# Altium project F2837x_180controlCARD_R1_3_SCH_PADS.PrjPcb (part 2 of 2)

## Sheet SUPPORT.SchDoc: F2837x controlCARD
size 431 x 279 mm; Organization: Texas Instruments; Revision: 1.3
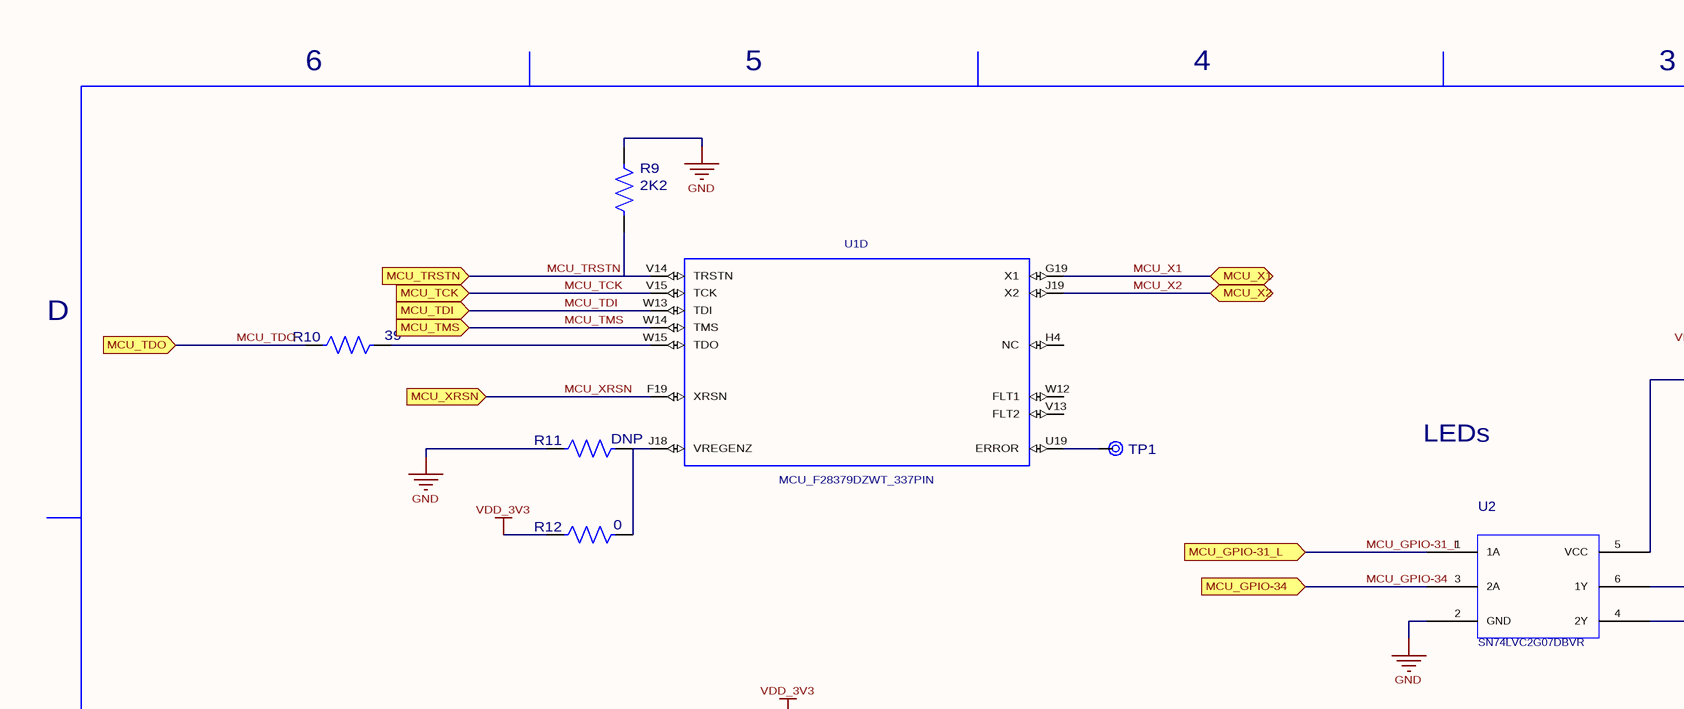
[diagram p19: SUPPORT.SchDoc, top left]
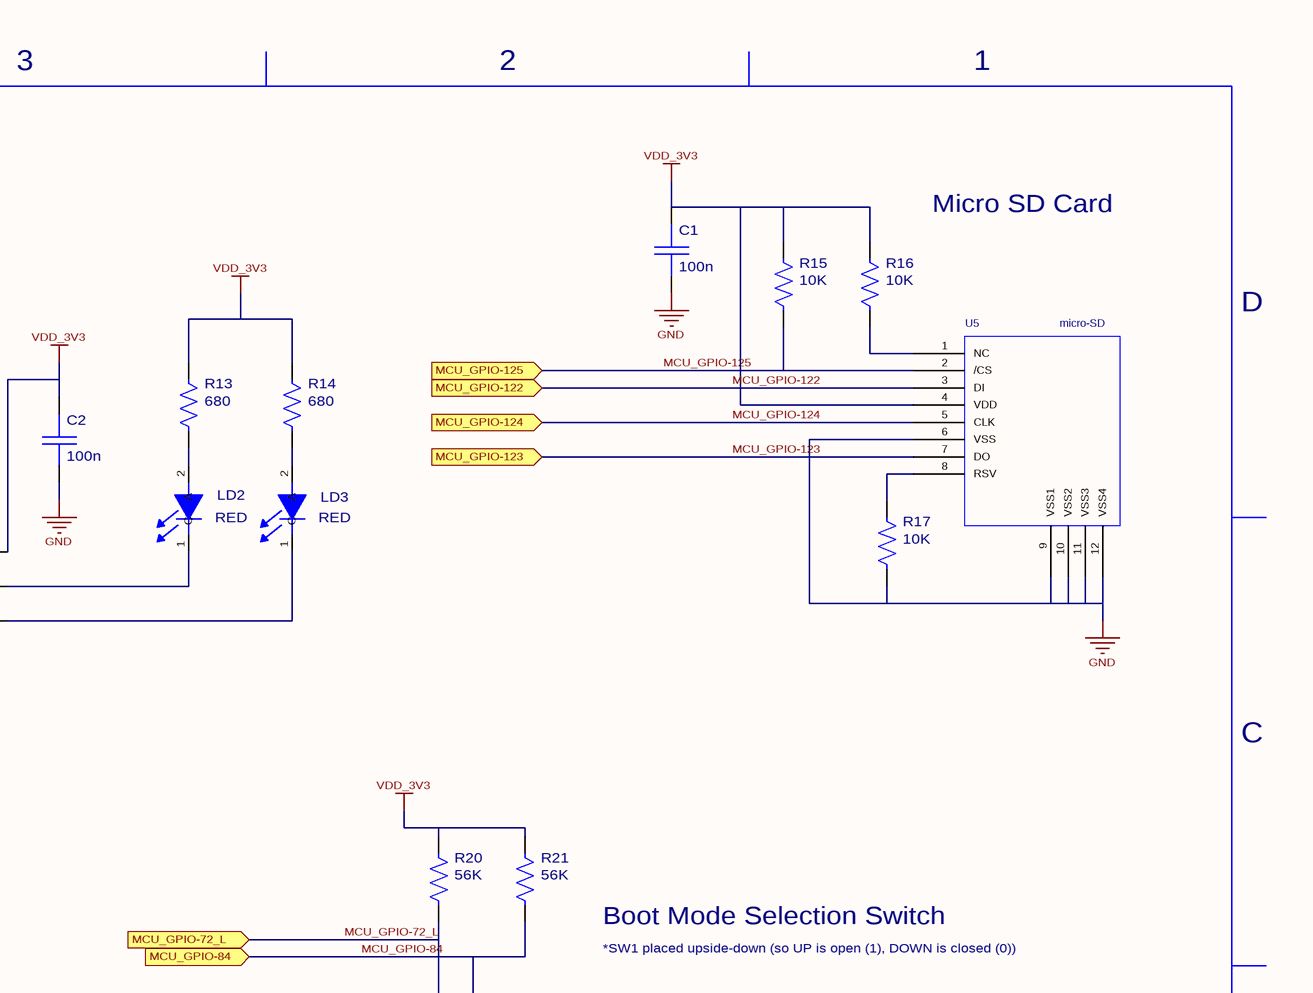
[diagram p20: SUPPORT.SchDoc, top right]
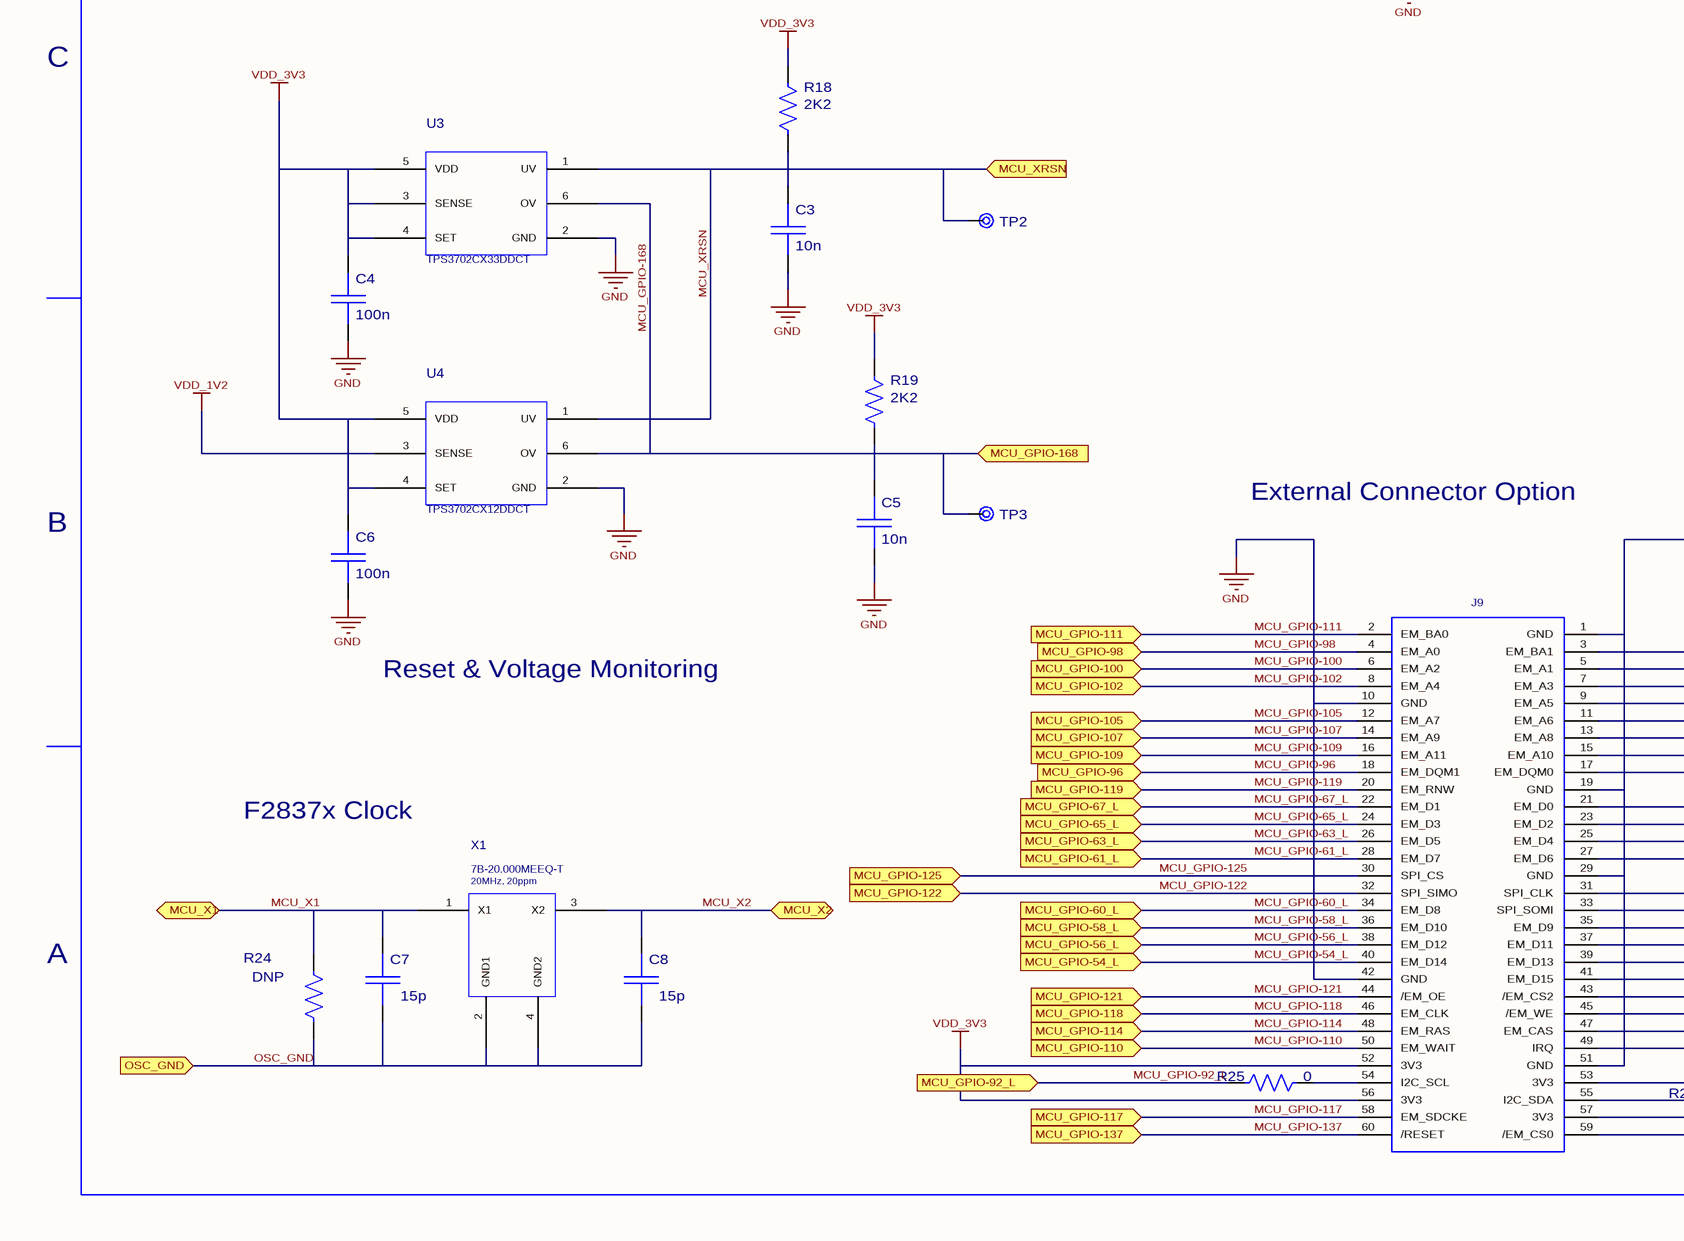
[diagram p21: SUPPORT.SchDoc, bottom left]
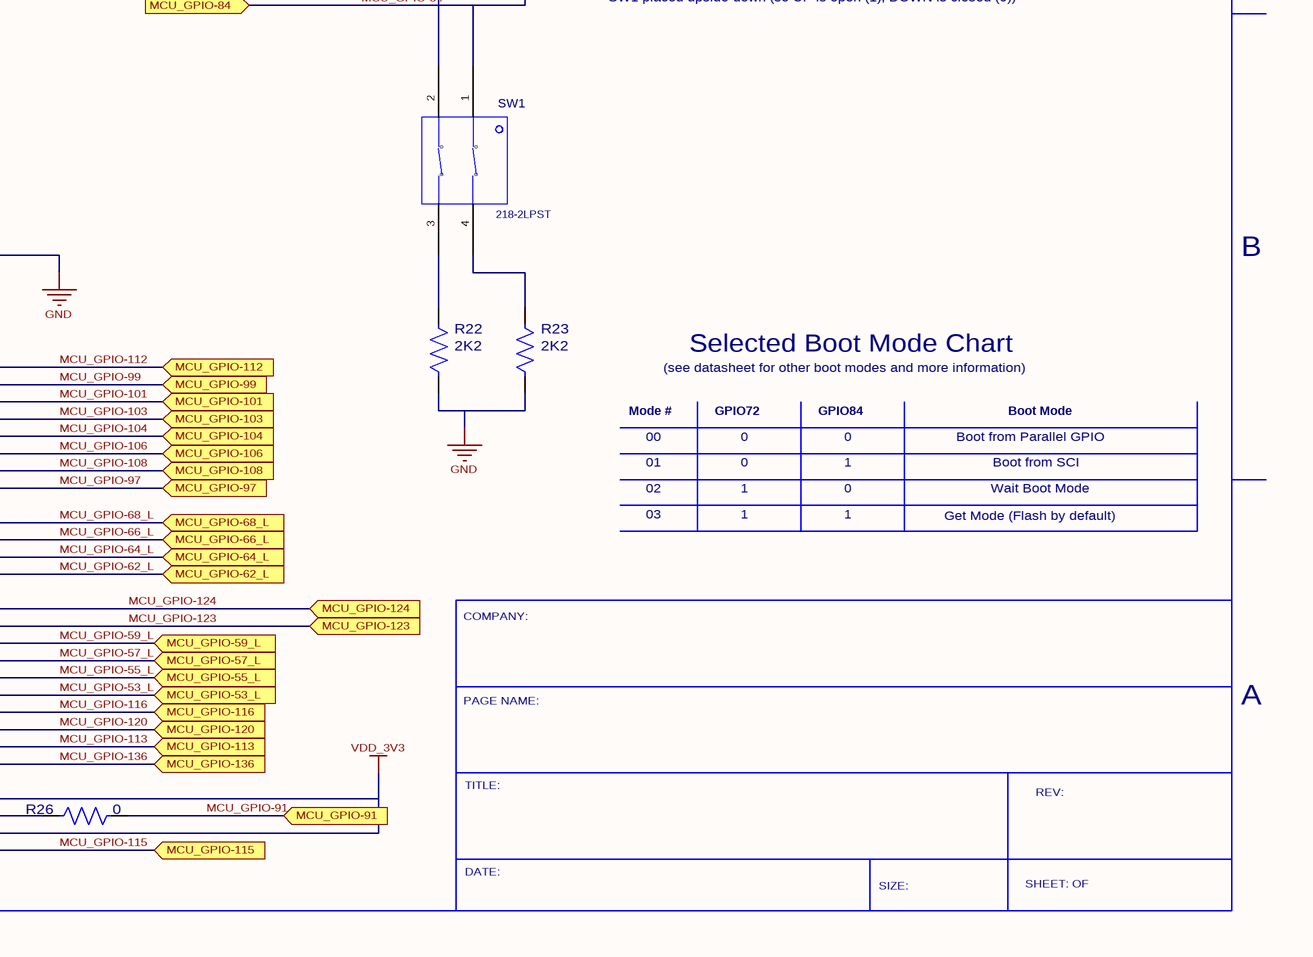
[diagram p22: SUPPORT.SchDoc, bottom right]

### Parts
C1  value 100n  [C0402]  (hidden comment: C0402_16V_X7R)
C2  value 100n  [C0402]  (hidden comment: C0402_16V_X7R)
C3  value 10n  [C0402]  (hidden comment: C0402_16V_X7R)
C4  value 100n  [C0402]  (hidden comment: C0402_16V_X7R)
C5  value 10n  [C0402]  (hidden comment: C0402_16V_X7R)
C6  value 100n  [C0402]  (hidden comment: C0402_16V_X7R)
C7  value 15p  [C0402]  (hidden comment: C0402_50V_NP0)
C8  value 15p  [C0402]  (hidden comment: C0402_50V_NP0)
J9  CONN_DF40C_CCARDIF_EMIFANDSPI  [DF40C-60DP-0.4V]  (value not drawn)
LD2  value RED  [LED0805]  (hidden comment: LED0805_RED)
LD3  value RED  [LED0805]  (hidden comment: LED0805_RED)
R9  value 2K2  [R0402]  (hidden comment: R0402_5%)
R10  value 39  [R0402]  (hidden comment: R0402_5%)
R11  value DNP  [R0402]  (hidden comment: R0402_5%)
R12  value 0  [R0402]  (hidden comment: R0402_5%)
R13  value 680  [R0402]  (hidden comment: R0402_5%)
R14  value 680  [R0402]  (hidden comment: R0402_5%)
R15  value 10K  [R0402]  (hidden comment: R0402_5%)
R16  value 10K  [R0402]  (hidden comment: R0402_5%)
R17  value 10K  [R0402]  (hidden comment: R0402_5%)
R18  value 2K2  [R0402]  (hidden comment: R0402_5%)
R19  value 2K2  [R0603]  (hidden comment: R0603_1%)
R20  value 56K  [R0402]  (hidden comment: R0402_5%)
R21  value 56K  [R0402]  (hidden comment: R0402_5%)
R22  value 2K2  [R0402]  (hidden comment: R0402_5%)
R23  value 2K2  [R0402]  (hidden comment: R0402_5%)
R24  value DNP  [R0402]  (hidden comment: R0402_5%)
R25  value 0  [R0402]  (hidden comment: R0402_5%)
R26  value 0  [R0402]  (hidden comment: R0402_5%)
SW1  value 218-2LPST  [SW_2POS_CTS218]  (hidden comment: SWITCH_2XSPST_SMT)
TP1  VIA_20_40  [VIA_20_40]  (value not drawn)
TP2  VIA_20_40  [VIA_20_40]  (value not drawn)
TP3  VIA_20_40  [VIA_20_40]  (value not drawn)
U1  MCU_F28379DZWT_337PIN  [TI_ZWT_337BGA]  (part D of 5)
U2  value SN74LVC2G07DBVR  [SOT-23-6]  (hidden comment: IC_LOGIC_SN74LVC2G07DBV)
U3  value TPS3702CX33DDCT  [SOT-23-6]  (hidden comment: IC_SVS_TPS3702CX33DDC)
U4  value TPS3702CX12DDCT  [SOT-23-6]  (hidden comment: IC_SVS_TPS3702CX12DDC)
U5  value micro-SD  [CONN_SDMICRO-3M-2900]  (hidden comment: CONN_MICROSD_2908-05WB-MG)
X1  value 20MHz, 20ppm  Part Number: 7B-20.000MEEQ-T  [XTAL_TXC_7B]  (hidden comment: XTAL_7B-20.000MEEQ-T)

### Ports
MCU_GPIO-31_L, MCU_GPIO-34, MCU_GPIO-53_L, MCU_GPIO-54_L, MCU_GPIO-55_L, MCU_GPIO-56_L, MCU_GPIO-57_L, MCU_GPIO-58_L, MCU_GPIO-59_L, MCU_GPIO-60_L, MCU_GPIO-61_L, MCU_GPIO-62_L, MCU_GPIO-63_L, MCU_GPIO-64_L, MCU_GPIO-65_L, MCU_GPIO-66_L, MCU_GPIO-67_L, MCU_GPIO-68_L, MCU_GPIO-72_L, MCU_GPIO-84, MCU_GPIO-91, MCU_GPIO-92_L, MCU_GPIO-96, MCU_GPIO-97, MCU_GPIO-98, MCU_GPIO-99, MCU_GPIO-100, MCU_GPIO-101, MCU_GPIO-102, MCU_GPIO-103, MCU_GPIO-104, MCU_GPIO-105, MCU_GPIO-106, MCU_GPIO-107, MCU_GPIO-108, MCU_GPIO-109, MCU_GPIO-110, MCU_GPIO-111, MCU_GPIO-112, MCU_GPIO-113, MCU_GPIO-114, MCU_GPIO-115, MCU_GPIO-116, MCU_GPIO-117, MCU_GPIO-118, MCU_GPIO-119, MCU_GPIO-120, MCU_GPIO-121, MCU_GPIO-122, MCU_GPIO-123, MCU_GPIO-124, MCU_GPIO-125, MCU_GPIO-136, MCU_GPIO-137, MCU_GPIO-168, MCU_TCK, MCU_TDI, MCU_TDO, MCU_TMS, MCU_TRSTN, MCU_X1 (bidir), MCU_X2 (bidir), MCU_XRSN, OSC_GND

### Nets
GND: C1.1 C2.1 C3.1 C4.1 C5.1 C6.1 J9.1(GND) J9.10(GND) J9.19(GND) J9.29(GND) J9.42(GND) J9.51(GND) R9.1 R11.1 R17.2 R22.2 R23.2 U2.2(GND) U3.2(GND) U4.2(GND) U5.6(VSS) U5.9(VSS1) U5.10(VSS2) U5.11(VSS3) U5.12(VSS4)
VDD_1V2: U4.3(SENSE)
VDD_3V3: C1.2 C2.2 C4.2 C6.2 J9.52(3V3) J9.53(3V3) J9.56(3V3) J9.57(3V3) R12.1 R13.1 R14.1 R15.1 R16.1 R18.1 R19.1 R20.1 R21.1 U2.5(VCC) U3.3(SENSE) U3.4(SET) U3.5(VDD) U4.4(SET) U4.5(VDD) U5.4(VDD)
MCU_GPIO-31_L: U2.1(1A) ; port MCU_GPIO-31_L
MCU_GPIO-34: U2.3(2A) ; port MCU_GPIO-34  [project net MCU_GPIO-20]
MCU_GPIO-53_L: J9.41(EM_D15) ; port MCU_GPIO-53_L
MCU_GPIO-54_L: J9.40(EM_D14) ; port MCU_GPIO-54_L
MCU_GPIO-55_L: J9.39(EM_D13) ; port MCU_GPIO-55_L
MCU_GPIO-56_L: J9.38(EM_D12) ; port MCU_GPIO-56_L
MCU_GPIO-57_L: J9.37(EM_D11) ; port MCU_GPIO-57_L
MCU_GPIO-58_L: J9.36(EM_D10) ; port MCU_GPIO-58_L
MCU_GPIO-59_L: J9.35(EM_D9) ; port MCU_GPIO-59_L
MCU_GPIO-60_L: J9.34(EM_D8) ; port MCU_GPIO-60_L
MCU_GPIO-61_L: J9.28(EM_D7) ; port MCU_GPIO-61_L
MCU_GPIO-62_L: J9.27(EM_D6) ; port MCU_GPIO-62_L
MCU_GPIO-63_L: J9.26(EM_D5) ; port MCU_GPIO-63_L
MCU_GPIO-64_L: J9.25(EM_D4) ; port MCU_GPIO-64_L
MCU_GPIO-65_L: J9.24(EM_D3) ; port MCU_GPIO-65_L
MCU_GPIO-66_L: J9.23(EM_D2) ; port MCU_GPIO-66_L
MCU_GPIO-67_L: J9.22(EM_D1) ; port MCU_GPIO-67_L
MCU_GPIO-68_L: J9.21(EM_D0) ; port MCU_GPIO-68_L
MCU_GPIO-72_L: R20.2 SW1.2(B_OUT2) ; port MCU_GPIO-72_L
MCU_GPIO-84: R21.2 SW1.1(A_OUT1) ; port MCU_GPIO-84
MCU_GPIO-91: R26.2 ; port MCU_GPIO-91
MCU_GPIO-92_L: R25.1 ; port MCU_GPIO-92_L
MCU_GPIO-96: J9.18(EM_DQM1) ; port MCU_GPIO-96
MCU_GPIO-97: J9.17(EM_DQM0) ; port MCU_GPIO-97
MCU_GPIO-98: J9.4(EM_A0) ; port MCU_GPIO-98
MCU_GPIO-99: J9.5(EM_A1) ; port MCU_GPIO-99
MCU_GPIO-100: J9.6(EM_A2) ; port MCU_GPIO-100
MCU_GPIO-101: J9.7(EM_A3) ; port MCU_GPIO-101
MCU_GPIO-102: J9.8(EM_A4) ; port MCU_GPIO-102
MCU_GPIO-103: J9.9(EM_A5) ; port MCU_GPIO-103
MCU_GPIO-104: J9.11(EM_A6) ; port MCU_GPIO-104
MCU_GPIO-105: J9.12(EM_A7) ; port MCU_GPIO-105
MCU_GPIO-106: J9.13(EM_A8) ; port MCU_GPIO-106
MCU_GPIO-107: J9.14(EM_A9) ; port MCU_GPIO-107
MCU_GPIO-108: J9.15(EM_A10) ; port MCU_GPIO-108
MCU_GPIO-109: J9.16(EM_A11) ; port MCU_GPIO-109
MCU_GPIO-110: J9.50(EM_WAIT) ; port MCU_GPIO-110
MCU_GPIO-111: J9.2(EM_BA0) ; port MCU_GPIO-111
MCU_GPIO-112: J9.3(EM_BA1) ; port MCU_GPIO-112
MCU_GPIO-113: J9.47(EM_CAS) ; port MCU_GPIO-113
MCU_GPIO-114: J9.48(EM_RAS) ; port MCU_GPIO-114
MCU_GPIO-115: J9.59(/EM_CS0) ; port MCU_GPIO-115
MCU_GPIO-116: J9.43(/EM_CS2) ; port MCU_GPIO-116
MCU_GPIO-117: J9.58(EM_SDCKE) ; port MCU_GPIO-117
MCU_GPIO-118: J9.46(EM_CLK) ; port MCU_GPIO-118
MCU_GPIO-119: J9.20(EM_RNW) ; port MCU_GPIO-119
MCU_GPIO-120: J9.45(/EM_WE) ; port MCU_GPIO-120
MCU_GPIO-121: J9.44(/EM_OE) ; port MCU_GPIO-121
MCU_GPIO-122: J9.32(SPI_SIMO) U5.3(DI) ; port MCU_GPIO-122
MCU_GPIO-123: J9.33(SPI_SOMI) U5.7(DO) ; port MCU_GPIO-123
MCU_GPIO-124: J9.31(SPI_CLK) U5.5(CLK) ; port MCU_GPIO-124
MCU_GPIO-125: J9.30(SPI_CS) R15.2 U5.2(/CS) ; port MCU_GPIO-125
MCU_GPIO-136: J9.49(IRQ) ; port MCU_GPIO-136
MCU_GPIO-137: J9.60(/RESET) ; port MCU_GPIO-137
MCU_GPIO-168: C5.2 R19.2 TP3.1 U3.6(OV) U4.6(OV) ; port MCU_GPIO-168
MCU_TCK: U1.V15(TCK) ; port MCU_TCK
MCU_TDI: U1.W13(TDI) ; port MCU_TDI
MCU_TDO: R10.1 ; port MCU_TDO
MCU_TMS: U1.W14(TMS) ; port MCU_TMS
MCU_TRSTN: R9.2 U1.V14(TRSTN) ; port MCU_TRSTN
MCU_X1: C7.2 R24.1 U1.G19(X1) X1.1(X1) ; port MCU_X1
MCU_X2: C8.2 U1.J19(X2) X1.3(X2) ; port MCU_X2
MCU_XRSN: C3.2 R18.2 TP2.1 U1.F19(XRSN) U3.1(UV) U4.1(UV) ; port MCU_XRSN
OSC_GND: C7.1 C8.1 R24.2 X1.2(GND1) X1.4(GND2) ; port OSC_GND
NetJ9_54: J9.54(I2C_SCL) R25.2
NetJ9_55: J9.55(I2C_SDA) R26.1
NetLD2_1: LD2.1(C) U2.6(1Y)
NetLD2_2: LD2.2(A) R13.2
NetLD3_1: LD3.1(C) U2.4(2Y)
NetLD3_2: LD3.2(A) R14.2
NetR10_2: R10.2 U1.W15(TDO)
NetR11_2: R11.2 R12.2 U1.J18(VREGENZ)
NetR16_2: R16.2 U5.1(NC)
NetR17_1: R17.1 U5.8(RSV)
NetR22_1: R22.1 SW1.3(B_IN1)
NetR23_1: R23.1 SW1.4(A_IN1)
NetTP1_1: TP1.1 U1.U19(ERROR)

Not connected (* = marked no-connect by the designer): U1 H4(NC) V13(FLT2) W12(FLT1)

### Notes on the sheet
- 6
- 5
- 4
- 3
- 2
- 1
- Micro SD Card
- D
- LEDs
- C
- *SW1 placed upside-down (so UP is open (1), DOWN is closed (0))
- Boot Mode Selection Switch
- External Connector Option
- B
- Reset & Voltage Monitoring
- (see datasheet for other boot modes and more information)
- Selected Boot Mode Chart
- Mode #
- 01
- 00
- GPIO72
- 0
- GPIO84
- Boot from Parallel GPIO
- Boot from SCI
- Boot Mode
- F2837x Clock
- 03
- 02
- Get Mode (Flash by default)
- Wait Boot Mode
- COMPANY:
- A
- PAGE NAME:
- TITLE:
- REV:
- DATE:
- SIZE:
- SHEET: OF
- (in symbol SWITCH_2XSPST_SMT) o

### Library data of the parts
C1-C6 = C0402_16V_X7R: CAP CER 16V 10% X7R 0402; Decal: C0402; PCB DECAL: C0402
C7 C8 = C0402_50V_NP0: CAP CER 50V NP0 0402; Decal: C0402; PCB DECAL: C0402
J9 = CONN_DF40C_CCARDIF_EMIFANDSPI: 60pin connector - SMT, Hirose DF40C-60DP-0.4V(51); Decal: DF40C-60DP-0.4V; Digikey: H11628CT-ND; Manufacturer: Hirose; Part Number: DF40C-60DP-0.4V(51); PCB DECAL: DF40C-60DP-0.4V
LD2 LD3 = LED0805_RED: LED RED 0805 SMD, Diffused, 647nm; Decal: LED0805; PCB DECAL: LED0805
R9-R18 R20-R26 = R0402_5%: RES 1/16W 5% 0402 SMD; Decal: R0402; PCB DECAL: R0402
R19 = R0603_1%: RES 1/10W 1% 0603 SMD; Decal: R0603; PCB DECAL: R0603
SW1 = SWITCH_2XSPST_SMT: 2xSPST DIP switch SMT, half-pitch; Manufacturer: CTS Electrocomponents; Decal: SW_2POS_CTS218; Digikey: CT2182LPST-ND; Part Number: 218-2LPST; Size: 3.71 L x 8.89 W, 1.27 LS (mm); Height: 2.65 (mm); PCB DECAL: SW_2POS_CTS218
TP1-TP3 = VIA_20_40: Via, 20 ID, 40 OD (mil); Decal: VIA_20_40; Size: 20 ID, 40 OD (mil); PCB DECAL: VIA_20_40
U1 = MCU_F28379DZWT_337PIN: MCU F2837x 337pin ZWT BGA; Part Number: TMS320F28379DZWT; Decal: TI_ZWT_337BGA; PCB DECAL: TI_ZWT_337BGA
U2 = IC_LOGIC_SN74LVC2G07DBV: Buffer Line Driver, non-inverting, 32mA; Manufacturer: Texas Instruments; PCB DECAL: SOT-23-6; Decal: SOT-23-6; Digikey: 296-13494-1-ND; Part Number: SN74LVC2G07DBVR
U3 = IC_SVS_TPS3702CX33DDC: Volage Monitor, 3.3V, 5% or 10%; Manufacturer: Texas Instruments; Decal: SOT-23-6; Digikey: 296-39651-1-ND; Part Number: TPS3702CX33DDCT; PCB DECAL: SOT-23-6
U4 = IC_SVS_TPS3702CX12DDC: Volage Monitor, 1.2V, 5% or 10%; Manufacturer: Texas Instruments; Decal: SOT-23-6; Digikey: 296-42074-1-ND; Part Number: TPS3702CX12DDCT; PCB DECAL: SOT-23-6
U5 = CONN_MICROSD_2908-05WB-MG: micro SD Connector+Ejector, 10 (8+2) positions, SMT-top; Manufacturer: 3M; Decal: CONN_SDMICRO-3M-2900; Digikey: 3M5607CT-ND; Height: 1.85 (mm); Part Number: 2908-05WB-MG; PCB DECAL: CONN_SDMICRO-3M-2900
X1 = XTAL_7B-20.000MEEQ-T: 20MHz Crystal, 20ppm; Manufacturer: TXC Corporation; Decal: XTAL_TXC_7B; Digikey: 887-1303-1-ND; Height: 1.05 (mm); Size: 5 L x 3.2 W (mm); PCB DECAL: XTAL_TXC_7B

## Sheet XDS100V2_EMULATOR.SchDoc: F2837x controlCARD
size 431 x 279 mm; Organization: Texas Instruments; Revision: 1.3
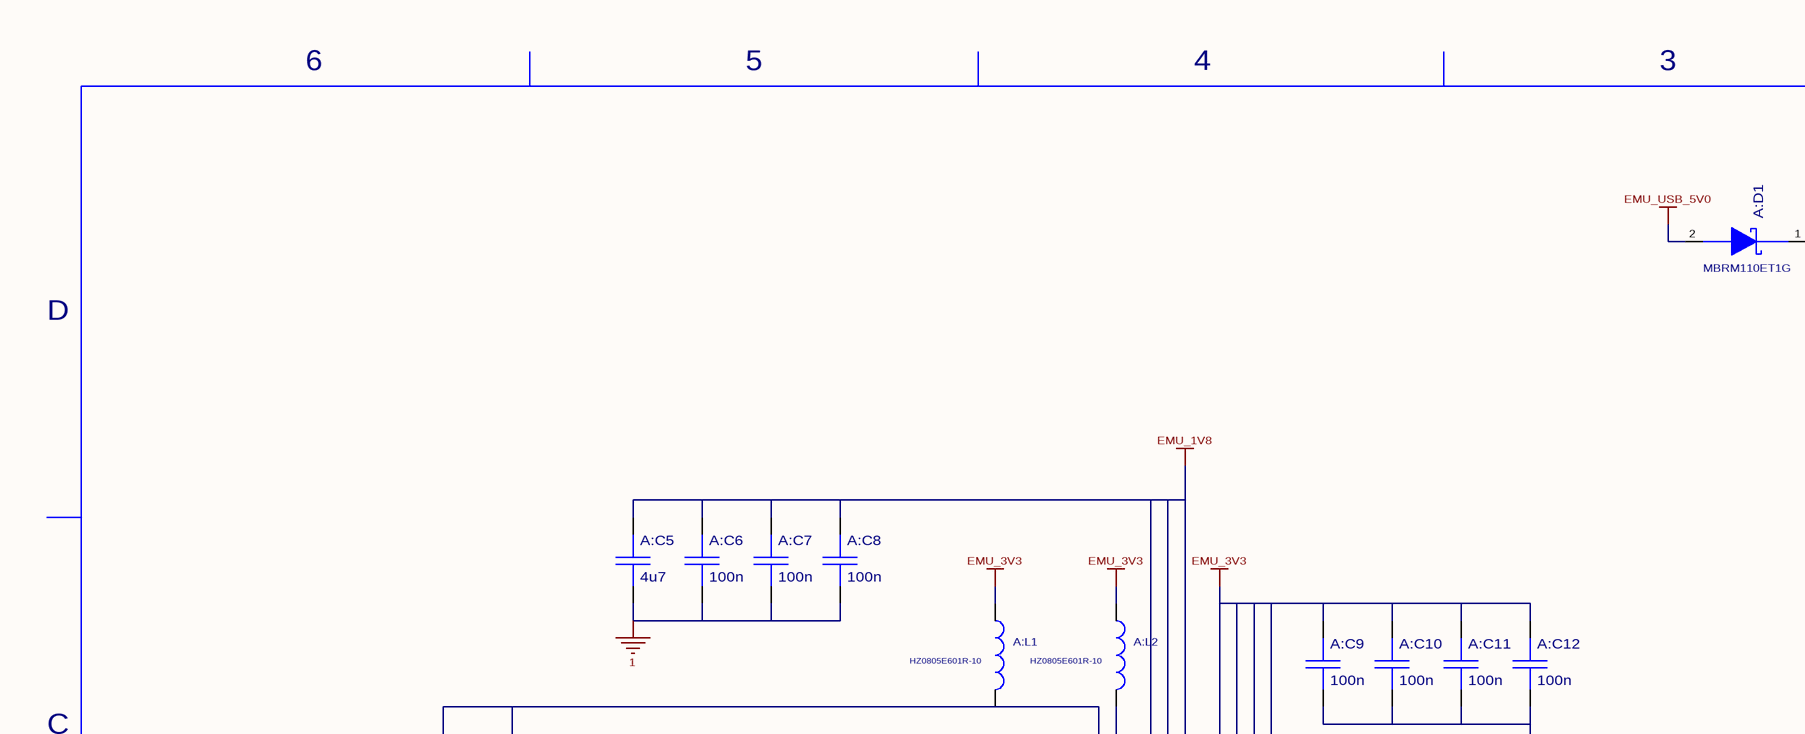
[diagram p23: XDS100V2_EMULATOR.SchDoc, top left]
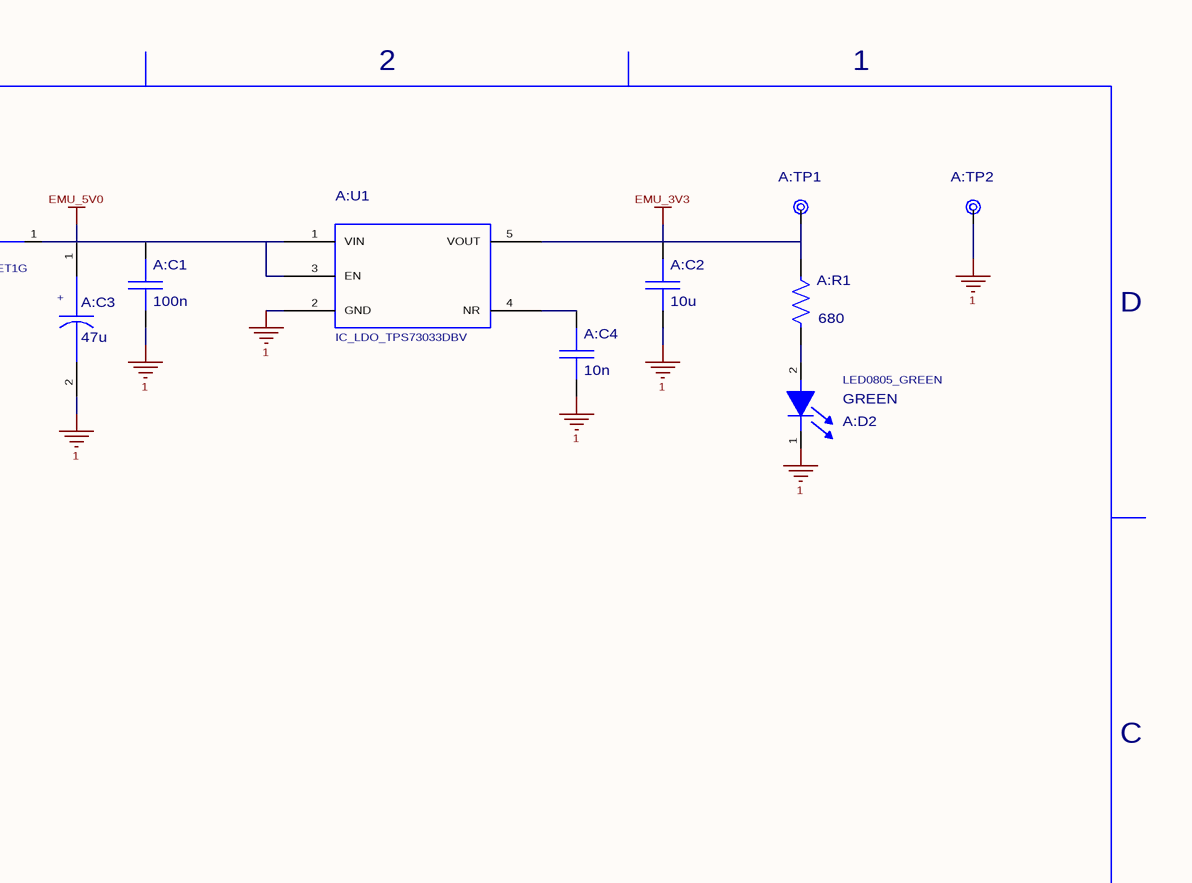
[diagram p24: XDS100V2_EMULATOR.SchDoc, top right]
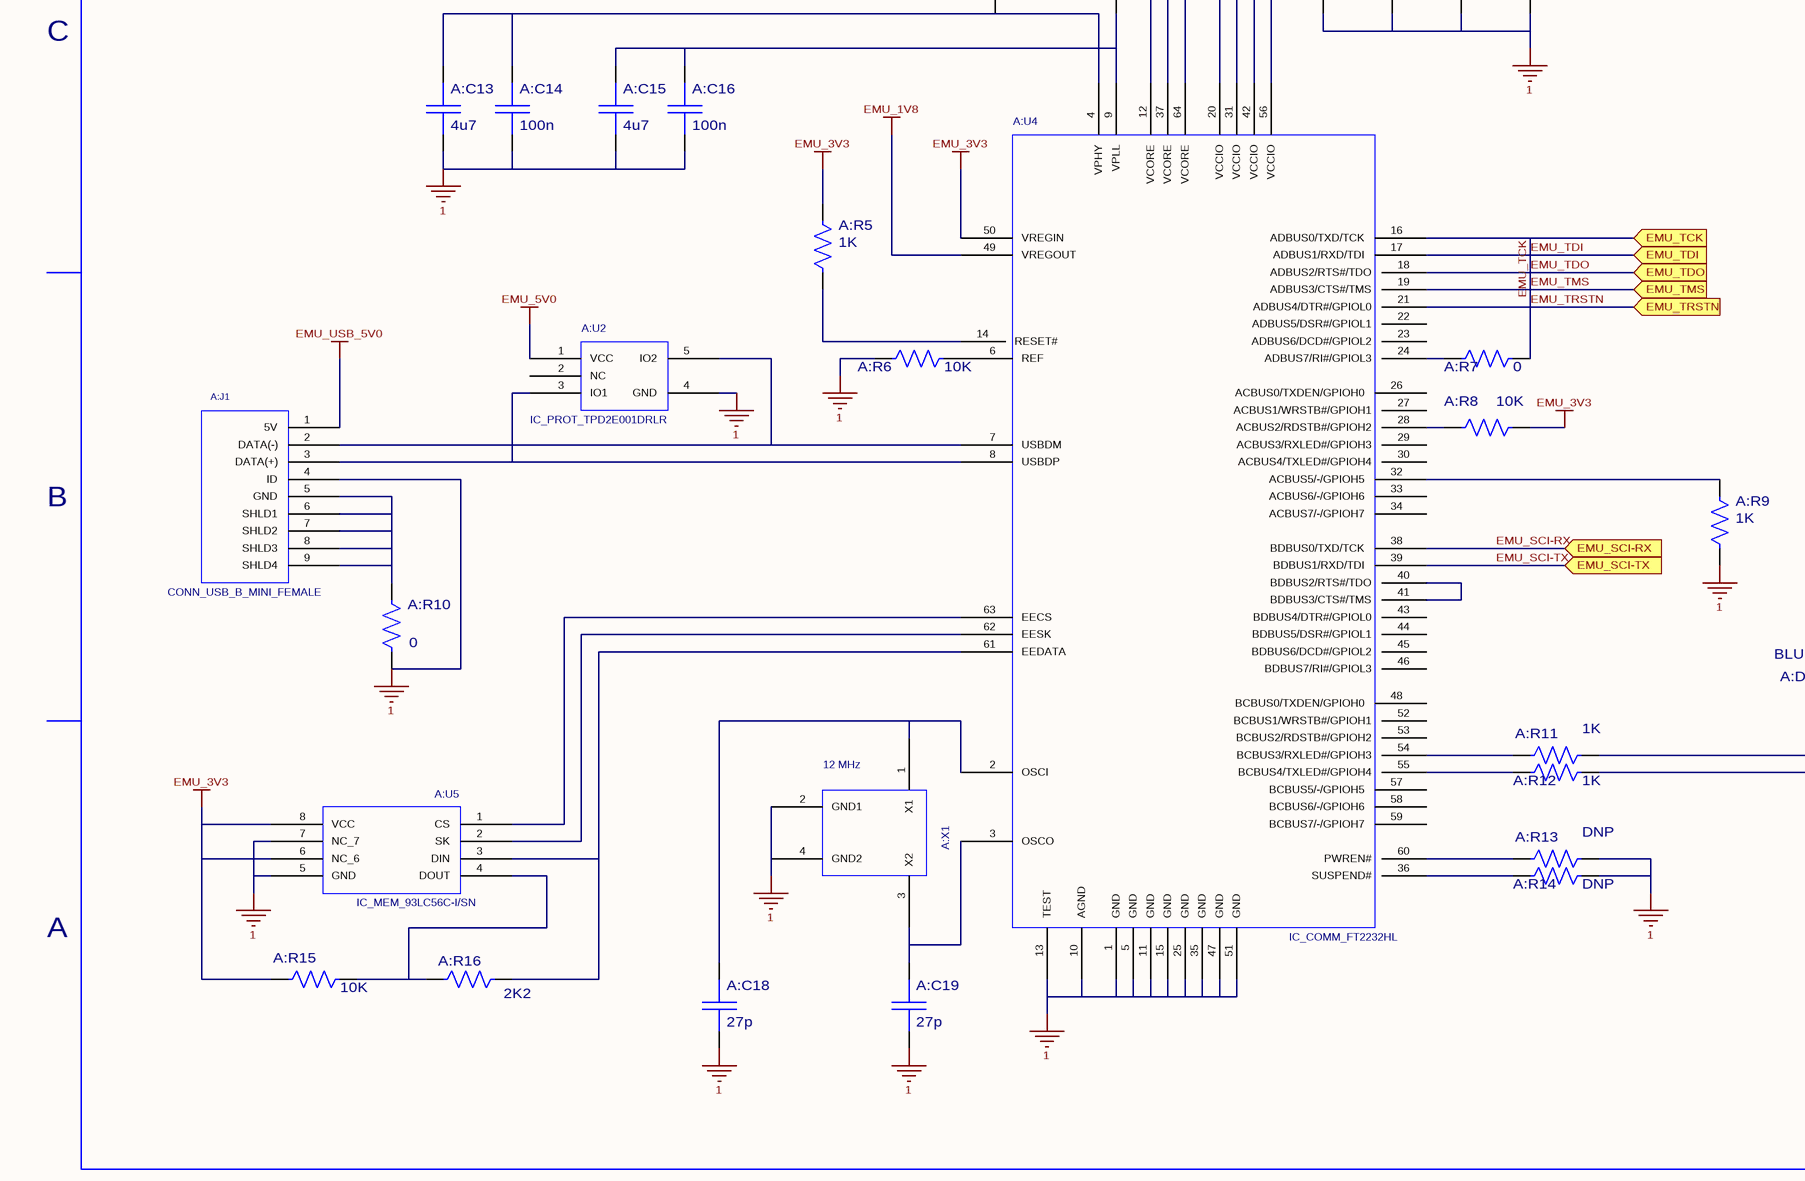
[diagram p25: XDS100V2_EMULATOR.SchDoc, bottom left]
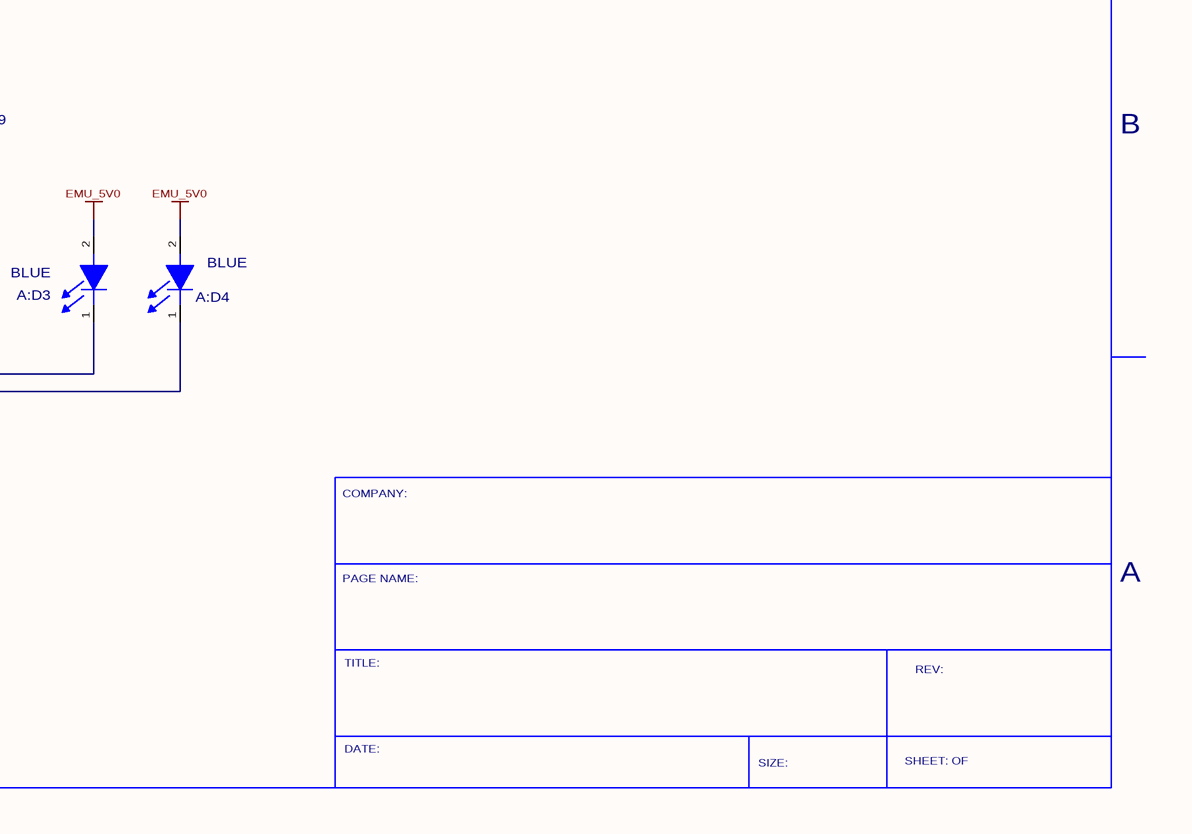
[diagram p26: XDS100V2_EMULATOR.SchDoc, bottom right]

### Parts
A:C1  value 100n  [C0402]  (hidden comment: C0402_16V_X7R)
A:C2  value 10u  [C0603]  (hidden comment: C0603_16V_X7R)
A:C3  value 47u  [C0805P]  (hidden comment: C0805_10V_TANT)
A:C4  value 10n  [C0402]  (hidden comment: C0402_16V_X7R)
A:C5  value 4u7  [C0603]  (hidden comment: C0603_16V_X7R)
A:C6  value 100n  [C0402]  (hidden comment: C0402_16V_X7R)
A:C7  value 100n  [C0402]  (hidden comment: C0402_16V_X7R)
A:C8  value 100n  [C0402]  (hidden comment: C0402_16V_X7R)
A:C9  value 100n  [C0402]  (hidden comment: C0402_16V_X7R)
A:C10  value 100n  [C0402]  (hidden comment: C0402_16V_X7R)
A:C11  value 100n  [C0402]  (hidden comment: C0402_16V_X7R)
A:C12  value 100n  [C0402]  (hidden comment: C0402_16V_X7R)
A:C13  value 4u7  [C0603]  (hidden comment: C0603_16V_X7R)
A:C14  value 100n  [C0402]  (hidden comment: C0402_16V_X7R)
A:C15  value 4u7  [C0603]  (hidden comment: C0603_16V_X7R)
A:C16  value 100n  [C0402]  (hidden comment: C0402_16V_X7R)
A:C18  value 27p  [C0402]  (hidden comment: C0402_50V_NP0)
A:C19  value 27p  [C0402]  (hidden comment: C0402_50V_NP0)
A:D1  Part Number: MBRM110ET1G  [DO-216AA]  (hidden comment: DIODE_SCHOTTKY_MBRM110ET1G)
A:D2  LED0805_GREEN  value GREEN  [LED0805]
A:D3  value BLUE  [LED0805]  (hidden comment: LED0805_BLUE)
A:D4  value BLUE  [LED0805]  (hidden comment: LED0805_BLUE)
A:J1  CONN_USB_B_MINI_FEMALE  [CONN_USB_B_MINI_FEMALE]
A:L1  Part Number: HZ0805E601R-10  [L0805]  (hidden comment: L0805_HZ0805E601R-10)
A:L2  Part Number: HZ0805E601R-10  [L0805]  (hidden comment: L0805_HZ0805E601R-10)
A:R1  value 680  [R0402]  (hidden comment: R0402_5%)
A:R5  value 1K  [R0402]  (hidden comment: R0402_5%)
A:R6  value 10K  [R0402]  (hidden comment: R0402_5%)
A:R7  value 0  [R0402]  (hidden comment: R0402_5%)
A:R8  value 10K  [R0402]  (hidden comment: R0402_5%)
A:R9  value 1K  [R0402]  (hidden comment: R0402_5%)
A:R10  value 0  [R0402]  (hidden comment: R0402_5%)
A:R11  value 1K  [R0402]  (hidden comment: R0402_5%)
A:R12  value 1K  [R0402]  (hidden comment: R0402_5%)
A:R13  value DNP  [R0402]  (hidden comment: R0402_5%)
A:R14  value DNP  [R0402]  (hidden comment: R0402_5%)
A:R15  value 10K  [R0402]  (hidden comment: R0402_5%)
A:R16  value 2K2  [R0402]  (hidden comment: R0402_5%)
A:TP1  VIA_20_40  [VIA_20_40]  (value not drawn)
A:TP2  VIA_20_40  [VIA_20_40]  (value not drawn)
A:U1  IC_LDO_TPS73033DBV  [SOT-23-5]
A:U2  IC_PROT_TPD2E001DRLR  [SOT-553-5]
A:U4  IC_COMM_FT2232HL  [QFN-64]
A:U5  IC_MEM_93LC56C-I/SN  [SOIC-8]
A:X1  value 12 MHz  [OSC_ECS-120-20-30B]  (hidden comment: OSC_ECS-120-20-30B-TR)

### Ports
EMU_SCI-RX, EMU_SCI-TX, EMU_TCK, EMU_TDI, EMU_TDO, EMU_TMS, EMU_TRSTN

### Nets
1: A:C1.1 A:C2.1 A:C3.2 A:C4.1 A:C5.1 A:C6.1 A:C7.1 A:C8.1 A:C9.1 A:C10.1 A:C11.1 A:C12.1 A:C13.1 A:C14.1 A:C15.1 A:C16.1 A:C18.1 A:C19.1 A:D2.1(C) A:J1.4(ID) A:R6.1 A:R9.2 A:R10.2 A:R13.2 A:R14.2 A:TP2.1 A:U1.2(GND) A:U2.4(GND) A:U4.1(GND) A:U4.5(GND) A:U4.10(AGND) A:U4.11(GND) A:U4.13(TEST) A:U4.15(GND) A:U4.25(GND) A:U4.35(GND) A:U4.47(GND) A:U4.51(GND) A:U5.5(GND) A:U5.7(NC_7) A:X1.2(GND1) A:X1.4(GND2)
EMU_1V8: A:C5.2 A:C6.2 A:C7.2 A:C8.2 A:U4.12(VCORE) A:U4.37(VCORE) A:U4.49(VREGOUT) A:U4.64(VCORE)
EMU_3V3: A:C2.2 A:C9.2 A:C10.2 A:C11.2 A:C12.2 A:L1.1 A:L2.1 A:R1.1 A:R5.1 A:R8.2 A:R15.1 A:TP1.1 A:U1.5(VOUT) A:U4.20(VCCIO) A:U4.31(VCCIO) A:U4.42(VCCIO) A:U4.50(VREGIN) A:U4.56(VCCIO) A:U5.6(NC_6) A:U5.8(VCC)
EMU_5V0: A:C1.2 A:C3.1 A:D1.1(C) A:D3.2(A) A:D4.2(A) A:U1.1(VIN) A:U1.3(EN) A:U2.1(VCC)
EMU_USB_5V0: A:D1.2(A) A:J1.1(5V)
EMU_SCI-RX: A:U4.38(BDBUS0/TXD/TCK) ; port EMU_SCI-RX
EMU_SCI-TX: A:U4.39(BDBUS1/RXD/TDI) ; port EMU_SCI-TX
EMU_TCK: A:R7.2 A:U4.16(ADBUS0/TXD/TCK) A:U4.17(ADBUS1/RXD/TDI) A:U4.18(ADBUS2/RTS#/TDO) A:U4.19(ADBUS3/CTS#/TMS) A:U4.21(ADBUS4/DTR#/GPIOL0) ; port EMU_TCK, port EMU_TDI, port EMU_TRSTN, port EMU_TMS, port EMU_TDO  [also labelled EMU_TDI, EMU_TDO, EMU_TMS, EMU_TRSTN]
NetA:C4_2: A:C4.2 A:U1.4(NR)
NetA:C13_2: A:C13.2 A:C14.2 A:L1.2 A:U4.4(VPHY)
NetA:C15_2: A:C15.2 A:C16.2 A:L2.2 A:U4.9(VPLL)
NetA:C18_2: A:C18.2 A:U4.2(OSCI) A:X1.1(X1)
NetA:C19_2: A:C19.2 A:U4.3(OSCO) A:X1.3(X2)
NetA:D2_2: A:D2.2(A) A:R1.2
NetA:D3_1: A:D3.1(C) A:R11.2
NetA:D4_1: A:D4.1(C) A:R12.2
NetA:J1_2: A:J1.2(DATA(-)) A:U2.5(IO2) A:U4.7(USBDM)
NetA:J1_3: A:J1.3(DATA(+)) A:U2.3(IO1) A:U4.8(USBDP)
NetA:J1_5: A:J1.5(GND) A:J1.6(SHLD1) A:J1.7(SHLD2) A:J1.8(SHLD3) A:J1.9(SHLD4) A:R10.1
NetA:R5_2: A:R5.2 A:U4.14(RESET#)
NetA:R6_2: A:R6.2 A:U4.6(REF)
NetA:R7_1: A:R7.1 A:U4.24(ADBUS7/RI#/GPIOL3)
NetA:R8_1: A:R8.1 A:U4.28(ACBUS2/RDSTB#/GPIOH2)
NetA:R9_1: A:R9.1 A:U4.32(ACBUS5/-/GPIOH5)
NetA:R11_1: A:R11.1 A:U4.54(BCBUS3/RXLED#/GPIOH3)
NetA:R12_1: A:R12.1 A:U4.55(BCBUS4/TXLED#/GPIOH4)
NetA:R13_1: A:R13.1 A:U4.60(PWREN#)
NetA:R14_1: A:R14.1 A:U4.36(SUSPEND#)
NetA:R15_2: A:R15.2 A:R16.1 A:U5.4(DOUT)
NetA:R16_2: A:R16.2 A:U4.61(EEDATA) A:U5.3(DIN)
NetA:U4_40: A:U4.40(BDBUS2/RTS#/TDO) A:U4.41(BDBUS3/CTS#/TMS)
NetA:U4_62: A:U4.62(EESK) A:U5.2(SK)
NetA:U4_63: A:U4.63(EECS) A:U5.1(CS)

Not connected (* = marked no-connect by the designer): A:U2 2(NC); A:U4 22(ADBUS5/DSR#/GPIOL1) 23(ADBUS6/DCD#/GPIOL2) 26(ACBUS0/TXDEN/GPIOH0) 27(ACBUS1/WRSTB#/GPIOH1) 29(ACBUS3/RXLED#/GPIOH3) 30(ACBUS4/TXLED#/GPIOH4) 33(ACBUS6/-/GPIOH6) 34(ACBUS7/-/GPIOH7) 43(BDBUS4/DTR#/GPIOL0) 44(BDBUS5/DSR#/GPIOL1) 45(BDBUS6/DCD#/GPIOL2) 46(BDBUS7/RI#/GPIOL3) 48(BCBUS0/TXDEN/GPIOH0) 52(BCBUS1/WRSTB#/GPIOH1) 53(BCBUS2/RDSTB#/GPIOH2) 57(BCBUS5/-/GPIOH5) 58(BCBUS6/-/GPIOH6) 59(BCBUS7/-/GPIOH7)

### Notes on the sheet
- 6
- 5
- 4
- 3
- 2
- 1
- D
- C
- B
- COMPANY:
- A
- PAGE NAME:
- TITLE:
- REV:
- DATE:
- SIZE:
- SHEET: OF
- (in symbol C0805_10V_TANT) +

### Library data of the parts
A:C1 A:C4 A:C6-A:C12 A:C14 A:C16 = C0402_16V_X7R: CAP CER 16V 10% X7R 0402; Decal: C0402; PCB DECAL: C0402
A:C2 = C0603_16V_X7R: CAP CER 6.3V 20% X5R 0603; Decal: C0603; PCB DECAL: C0603
A:C3 = C0805_10V_TANT: CAP TANT 20% 0805 6.3V; Part Number: TCTP0J476M8R; Decal: C0805P; Digikey: 511-1682-1-ND; PCB DECAL: C0805P
A:C5 A:C13 A:C15 = C0603_16V_X7R: CAP CER 6.3V 10% X5R 0603; Decal: C0603; PCB DECAL: C0603
A:C18 A:C19 = C0402_50V_NP0: CAP CER 50V NP0 0402; Decal: C0402; PCB DECAL: C0402
A:D1 = DIODE_SCHOTTKY_MBRM110ET1G: DIODE SCHOTTKY 10V 1A POWERMITE; Manufacturer: On Semiconductor; Decal: DO-216AA; Digikey: MBRM110ET1GOSCT-ND; PCB DECAL: DO-216AA
A:D2 = LED0805_GREEN: LED GREEN 0805 SMD, Diffused, 567nm; Decal: LED0805; PCB DECAL: LED0805
A:D3 A:D4 = LED0805_BLUE: LED BLUE 0805 SMD, Clear, 470nm; Decal: LED0805; PCB DECAL: LED0805
A:J1 = CONN_USB_B_MINI_FEMALE: CONN RECEPT MINI USB2.0 5POS; Part Number: UX60-MB-5ST; Decal: CONN_USB_B_MINI_FEMALE; Digikey: H2959CT-ND; PCB DECAL: CONN_USB_B_MINI_FEMALE
A:L1 A:L2 = L0805_HZ0805E601R-10: FERRITE 500MA 600 OHM 0805 SMD; Decal: L0805; Digikey: 240-2399-1-ND; PCB DECAL: L0805
A:R1 A:R5-A:R16 = R0402_5%: RES 1/16W 5% 0402 SMD; Decal: R0402; PCB DECAL: R0402
A:TP1 A:TP2 = VIA_20_40: Via, 20 ID, 40 OD (mil); Decal: VIA_20_40; Size: 20 ID, 40 OD (mil); PCB DECAL: VIA_20_40
A:U1 = IC_LDO_TPS73033DBV: IC LDO REG HI-PSRR 3.3V SOT23-5; Decal: SOT-23-5; Digikey: 296-17580-1-ND; Part Number: TPS73033DBV; PCB DECAL: SOT-23-5
A:U2 = IC_PROT_TPD2E001DRLR: IC ESD-PROT ARRAY 2CH SOT-5; Decal: SOT-553-5; Digikey: 296-21883-1-ND; Part Number: TPD2E001DRLR; PCB DECAL: SOT-553-5
A:U4 = IC_COMM_FT2232HL: IC USB HS DUAL UART/FIFO 64-QFN; Decal: QFN-64; Digikey: 768-1024-1-ND; Part Number: FT2232HL; PCB DECAL: QFN-64
A:U5 = IC_MEM_93LC56C-I/SN: IC EEPROM 2KBIT 3MHZ 8SOIC; Decal: SOIC-8; Digikey: 93LC56C-I/SN-ND; Part Number: 93LC56C-I/SN; PCB DECAL: SOIC-8
A:X1 = OSC_ECS-120-20-30B-TR: CRYSTAL 12.000 MHZ 20PF SMD; Decal: OSC_ECS-120-20-30B; Digikey: XC1118CT-ND; Part Number: ECS-120-20-30B-TR; PCB DECAL: OSC_ECS-120-20-30B

## Sheet EMULATOR_INTERFACE.SchDoc: F2837x controlCARD
size 431 x 279 mm; Organization: Texas Instruments; Revision: 1.3
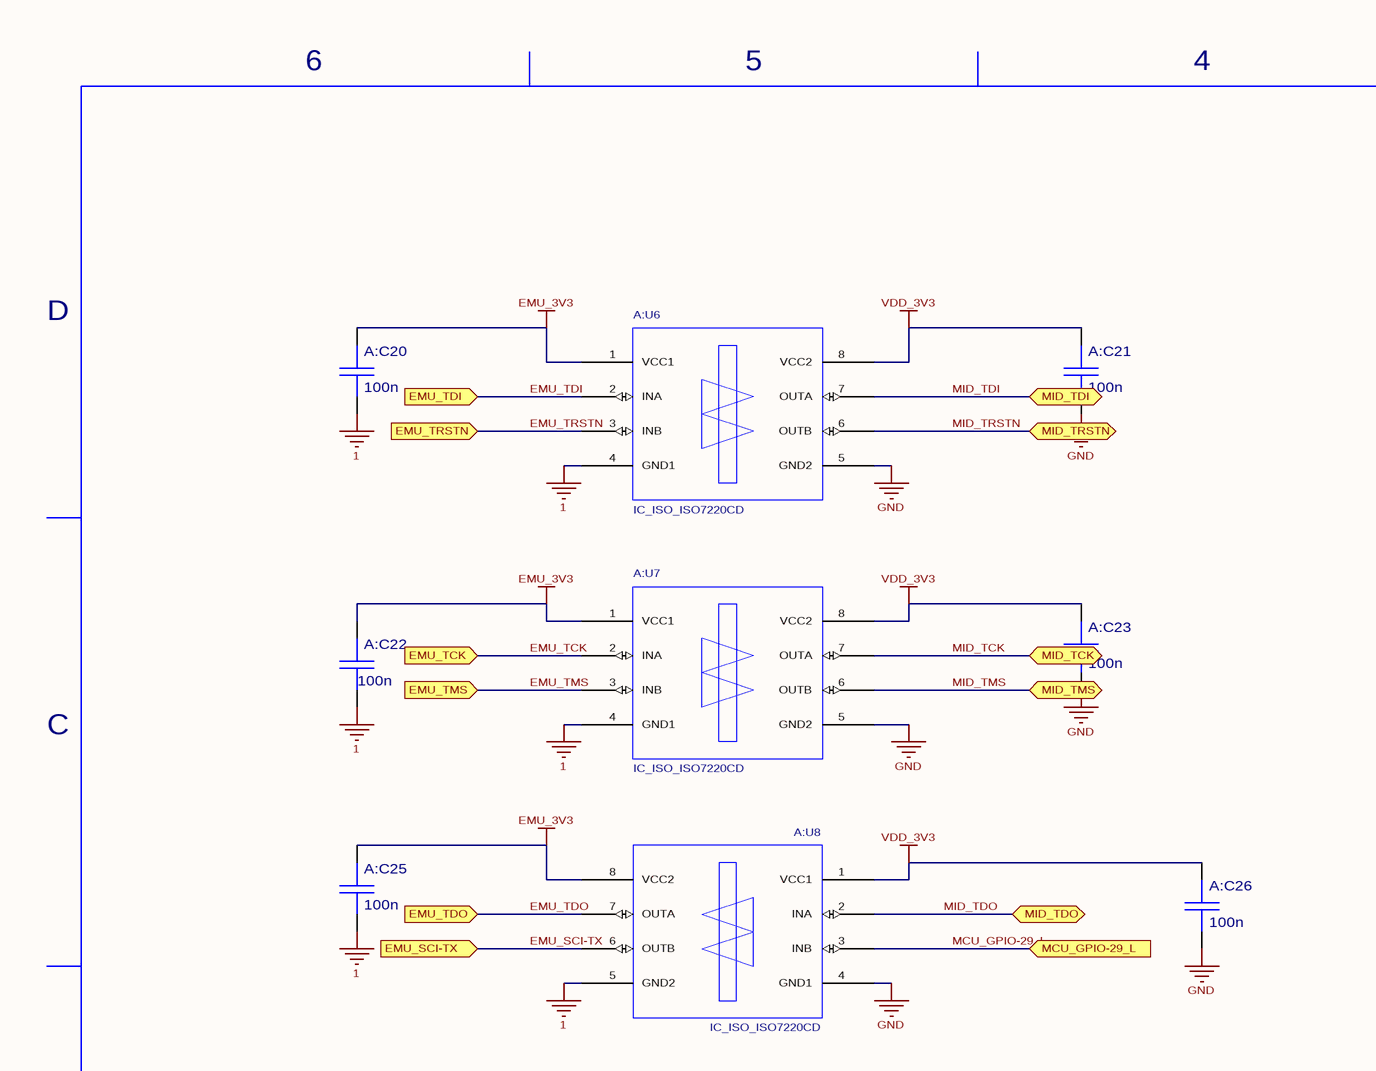
[diagram p27: EMULATOR_INTERFACE.SchDoc, top left]
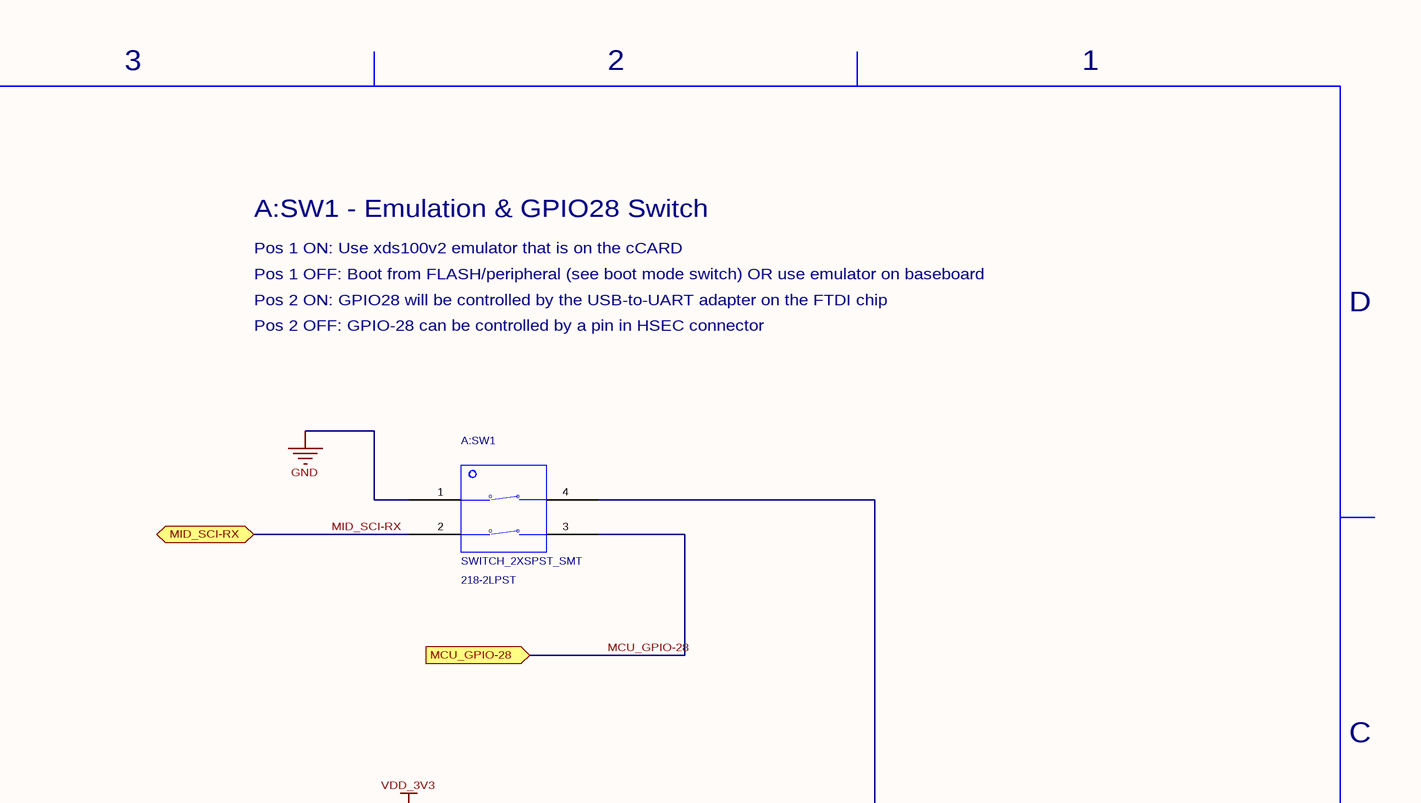
[diagram p28: EMULATOR_INTERFACE.SchDoc, top right]
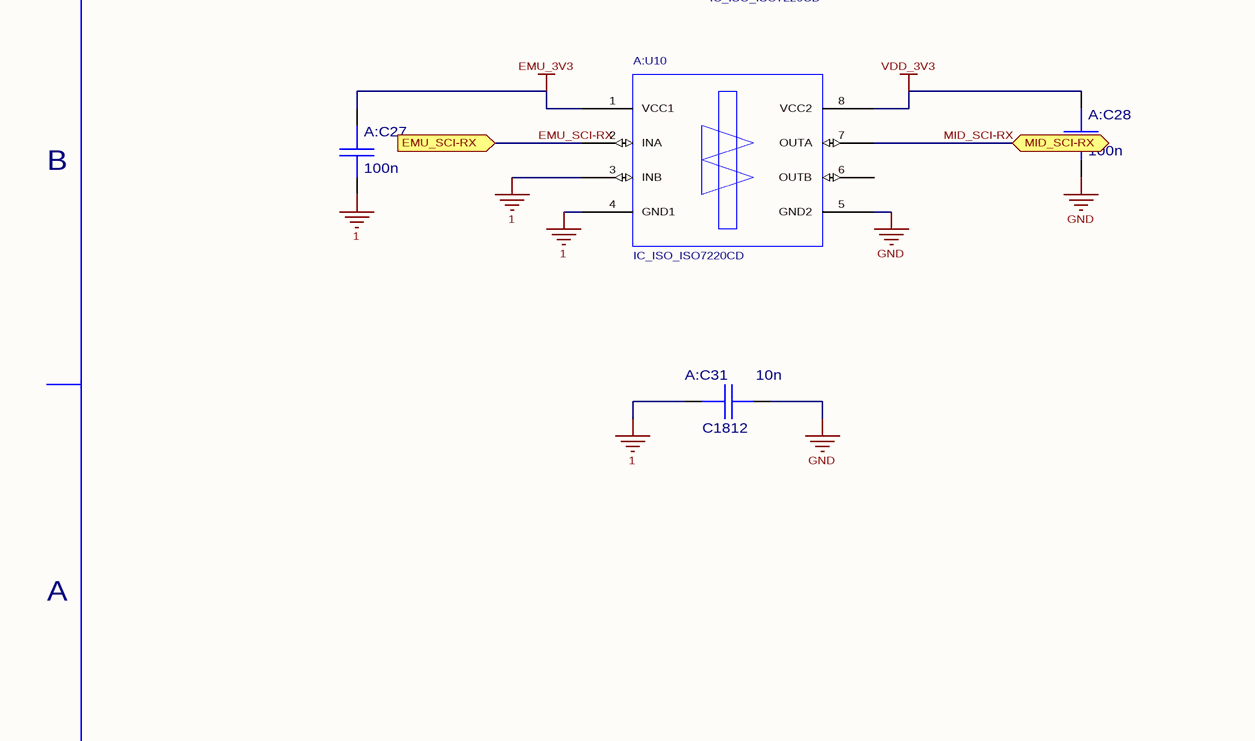
[diagram p29: EMULATOR_INTERFACE.SchDoc, bottom left]
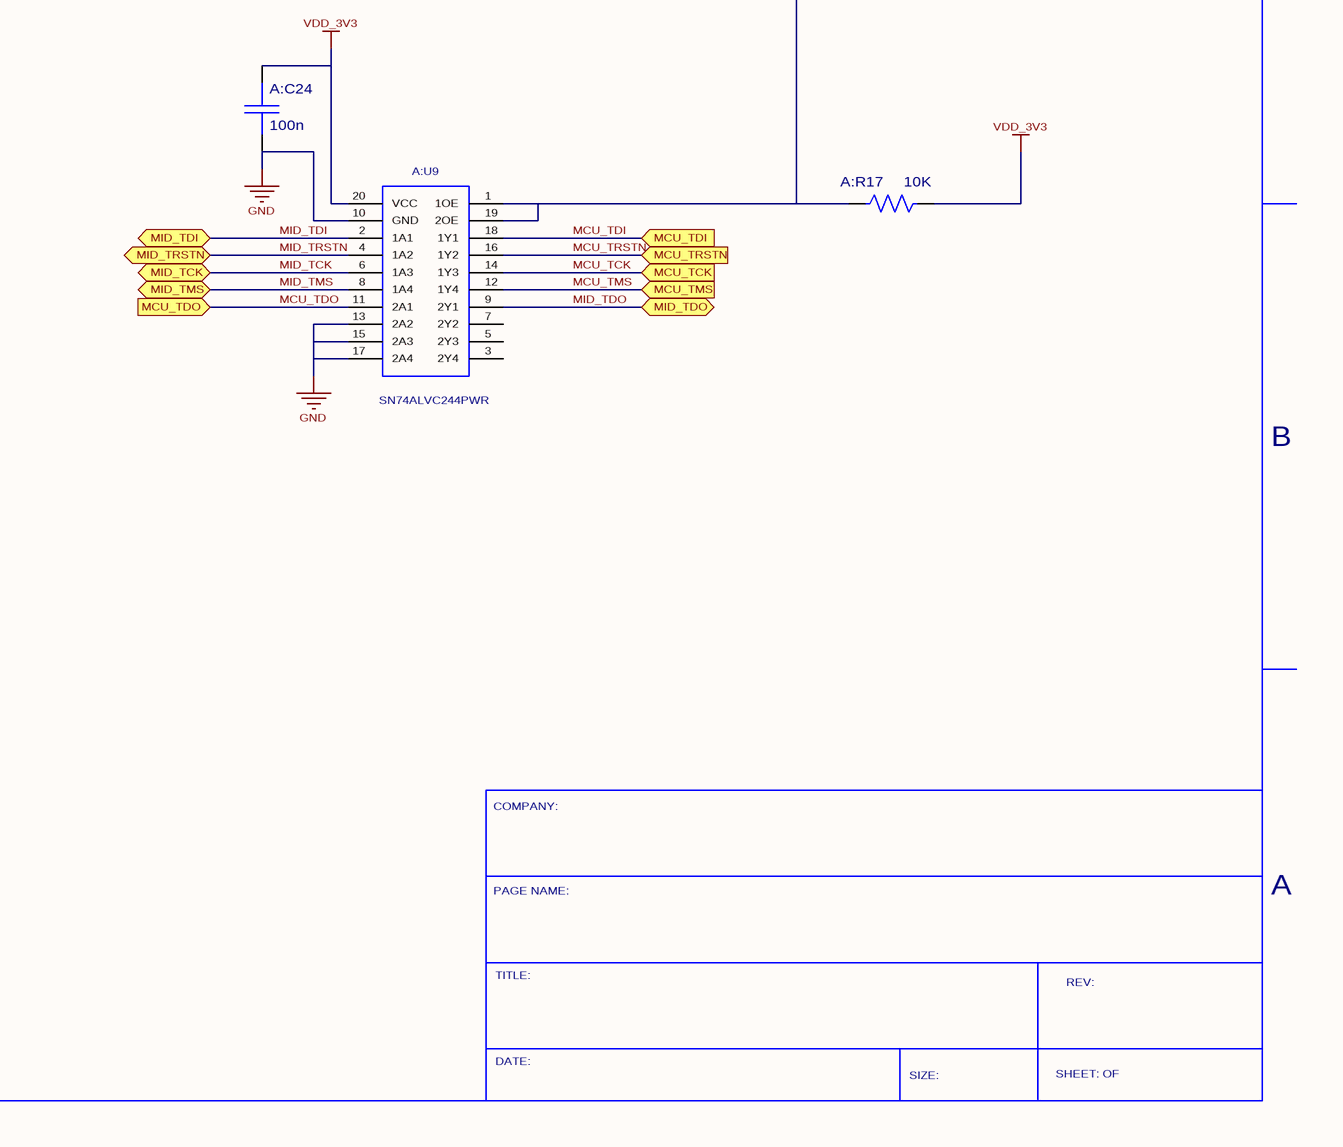
[diagram p30: EMULATOR_INTERFACE.SchDoc, bottom right]

### Parts
A:C20  value 100n  [C0402]  (hidden comment: C0402_16V_X7R)
A:C21  value 100n  [C0402]  (hidden comment: C0402_16V_X7R)
A:C22  value 100n  [C0402]  (hidden comment: C0402_16V_X7R)
A:C23  value 100n  [C0402]  (hidden comment: C0402_16V_X7R)
A:C24  value 100n  [C0402]  (hidden comment: C0402_16V_X7R)
A:C25  value 100n  [C0402]  (hidden comment: C0402_16V_X7R)
A:C26  value 100n  [C0402]  (hidden comment: C0402_16V_X7R)
A:C27  value 100n  [C0402]  (hidden comment: C0402_16V_X7R)
A:C28  value 100n  [C0402]  (hidden comment: C0402_16V_X7R)
A:C31  value 10n  [C1812]  (hidden comment: C1812_1.5KV_X7R)
A:R17  value 10K  [R0402]  (hidden comment: R0402_5%)
A:SW1  SWITCH_2XSPST_SMT  Part Number: 218-2LPST  [SW_2POS_CTS218]
A:U6  IC_ISO_ISO7220CD  [SOIC-8]
A:U7  IC_ISO_ISO7220CD  [SOIC-8]
A:U8  IC_ISO_ISO7220CD  [SOIC-8]
A:U9  Part Number: SN74ALVC244PWR  [TSSOP20_PW]  (hidden comment: IC_LOGIC_SN74ALVC244PW_3S-BUFFER)
A:U10  IC_ISO_ISO7220CD  [SOIC-8]

### Ports
EMU_SCI-RX, EMU_SCI-TX, EMU_TCK, EMU_TDI, EMU_TDO, EMU_TMS, EMU_TRSTN, MCU_GPIO-28, MCU_GPIO-29_L, MCU_TCK, MCU_TDI, MCU_TDO, MCU_TMS, MCU_TRSTN, MID_SCI-RX (bidir), MID_TCK (bidir), MID_TDI (bidir), MID_TDO (bidir), MID_TMS (bidir), MID_TRSTN (bidir)

### Nets
1: A:C20.1 A:C22.1 A:C25.1 A:C27.1 A:C31.2 A:U6.4(GND1) A:U7.4(GND1) A:U8.5(GND2) A:U10.3(INB) A:U10.4(GND1)
EMU_3V3: A:C20.2 A:C22.2 A:C25.2 A:C27.2 A:U6.1(VCC1) A:U7.1(VCC1) A:U8.8(VCC2) A:U10.1(VCC1)
GND: A:C21.1 A:C23.1 A:C24.1 A:C26.1 A:C28.1 A:C31.1 A:SW1.1(A_OUT1) A:U6.5(GND2) A:U7.5(GND2) A:U8.4(GND1) A:U9.10(GND) A:U9.13(2A2) A:U9.15(2A3) A:U9.17(2A4) A:U10.5(GND2)
VDD_3V3: A:C21.2 A:C23.2 A:C24.2 A:C26.2 A:C28.2 A:R17.2 A:U6.8(VCC2) A:U7.8(VCC2) A:U8.1(VCC1) A:U9.20(VCC) A:U10.8(VCC2)
EMU_SCI-RX: A:U10.2(INA) ; port EMU_SCI-RX
EMU_SCI-TX: A:U8.6(OUTB) ; port EMU_SCI-TX
EMU_TCK: A:U6.2(INA) A:U6.3(INB) A:U7.2(INA) A:U7.3(INB) A:U8.7(OUTA) ; port EMU_TCK, port EMU_TMS, port EMU_TDI, port EMU_TRSTN, port EMU_TDO  [also labelled EMU_TDI, EMU_TDO, EMU_TMS, EMU_TRSTN]
MCU_GPIO-28: A:SW1.3(B_IN1) ; port MCU_GPIO-28
MCU_GPIO-29_L: A:U8.3(INB) ; port MCU_GPIO-29_L
MCU_TCK: A:U9.14(1Y3) ; port MCU_TCK
MCU_TDI: A:U9.18(1Y1) ; port MCU_TDI
MCU_TDO: A:U9.11(2A1) ; port MCU_TDO
MCU_TMS: A:U9.12(1Y4) ; port MCU_TMS
MCU_TRSTN: A:U9.16(1Y2) ; port MCU_TRSTN
MID_SCI-RX: A:SW1.2(B_OUT2) A:U10.7(OUTA) ; port MID_SCI-RX
MID_TCK: A:U7.7(OUTA) A:U9.6(1A3) ; port MID_TCK
MID_TDI: A:U6.7(OUTA) A:U9.2(1A1) ; port MID_TDI
MID_TDO: A:U8.2(INA) A:U9.9(2Y1) ; port MID_TDO
MID_TMS: A:U7.6(OUTB) A:U9.8(1A4) ; port MID_TMS
MID_TRSTN: A:U6.6(OUTB) A:U9.4(1A2) ; port MID_TRSTN
NetA:R17_1: A:R17.1 A:SW1.4(A_IN1) A:U9.1(1OE) A:U9.19(2OE)

Not connected (* = marked no-connect by the designer): A:U9 3(2Y4) 5(2Y3) 7(2Y2); A:U10 6(OUTB)

### Notes on the sheet
- 6
- 5
- 4
- 3
- 2
- 1
- A:SW1 - Emulation & GPIO28 Switch
- Pos 1 ON: Use xds100v2 emulator that is on the cCARD
- Pos 1 OFF: Boot from FLASH/peripheral (see boot mode switch) OR use emulator on baseboard
- Pos 2 ON: GPIO28 will be controlled by the USB-to-UART adapter on the FTDI chip
- D
- Pos 2 OFF: GPIO-28 can be controlled by a pin in HSEC connector
- C
- B
- COMPANY:
- A
- PAGE NAME:
- TITLE:
- REV:
- DATE:
- SIZE:
- SHEET: OF
- (in symbol SWITCH_2XSPST_SMT) o

### Library data of the parts
A:C20-A:C28 = C0402_16V_X7R: CAP CER 16V 10% X7R 0402; Decal: C0402; PCB DECAL: C0402
A:C31 = C1812_1.5KV_X7R: CAP CER 1.5KV 10% X7R 1812; Part Number: 1812SC103KAT1A; Decal: C1812; Digikey: 478-4735-1-ND; PCB DECAL: C1812
A:R17 = R0402_5%: RES 1/16W 5% 0402 SMD; Decal: R0402; PCB DECAL: R0402
A:SW1 = SWITCH_2XSPST_SMT: 2xSPST DIP switch SMT, half-pitch; Manufacturer: CTS Electrocomponents; Value: 218-2LPST; PCB DECAL: SW_2POS_CTS218; Decal: SW_2POS_CTS218; Digikey: CT2182LPST-ND; Size: 3.71 L x 8.89 W, 1.27 LS (mm); Height: 2.65 (mm)
A:U6-A:U8 A:U10 = IC_ISO_ISO7220CD: IC DGTL ISOLATOR 25MBPS 2CH 8SOIC; Decal: SOIC-8; Digikey: 296-21953-1-ND; Part Number: ISO7220CD; PCB DECAL: SOIC-8
A:U9 = IC_LOGIC_SN74ALVC244PW_3S-BUFFER: 3-State Buffer, 2 elements x 4 bits; Manufacturer: Texas Instruments; Decal: TBD; Digikey: 296-5136-1-ND; Value: 3-State Buffer; PCB DECAL: TSSOP20_PW

## Nets that join several sheets
1: XDS100V2_EMULATOR (42 pins), EMULATOR_INTERFACE (10 pins)
EMU_3V3: XDS100V2_EMULATOR (20 pins), EMULATOR_INTERFACE (8 pins)
GND: GPIO,CONNECTOR (15 pins), ADC (56 pins), POWER (127 pins), USB (15 pins), SUPPORT (25 pins), EMULATOR_INTERFACE (15 pins)
MCU_GPIO-42: GPIO,CONNECTOR (8 pins), POWER (D1.2)
USB_5V0: POWER (R62.1), USB (5 pins)
VDD_1V2: POWER (8 pins), SUPPORT (U4.3)
VDD_3V3: GPIO,CONNECTOR (R1.1 R2.2), POWER (17 pins), USB (R85.1), SUPPORT (24 pins), EMULATOR_INTERFACE (11 pins)
VDDA_MCU_3V3: ADC (22 pins), POWER (C83.2 L5.2)
EMU_SCI-RX: XDS100V2_EMULATOR (A:U4.38), EMULATOR_INTERFACE (A:U10.2)
EMU_SCI-TX: XDS100V2_EMULATOR (A:U4.39), EMULATOR_INTERFACE (A:U8.6)
EMU_TCK: XDS100V2_EMULATOR (6 pins), EMULATOR_INTERFACE (5 pins)
HSEC_ADC-A0: GPIO,CONNECTOR (J1.9), ADC (R27.1)
HSEC_ADC-A1: GPIO,CONNECTOR (J1.11), ADC (R28.1)
HSEC_ADC-A2: GPIO,CONNECTOR (J1.15), ADC (R29.1)
HSEC_ADC-A3: GPIO,CONNECTOR (J1.17), ADC (R30.1)
HSEC_ADC-A4: GPIO,CONNECTOR (J1.21), ADC (R31.1)
HSEC_ADC-A5: GPIO,CONNECTOR (J1.23), ADC (R32.1)
HSEC_ADC-B0: GPIO,CONNECTOR (J1.12), ADC (R33.1)
HSEC_ADC-B1: GPIO,CONNECTOR (J1.14), ADC (R34.1)
HSEC_ADC-B2: GPIO,CONNECTOR (J1.18), ADC (R35.1)
HSEC_ADC-B3: GPIO,CONNECTOR (J1.20), ADC (R36.1)
HSEC_ADC-B4: GPIO,CONNECTOR (J1.24), ADC (R37.1)
HSEC_ADC-B5: GPIO,CONNECTOR (J1.26), ADC (R38.1)
HSEC_ADC-C2: GPIO,CONNECTOR (J1.31), ADC (R41.1)
HSEC_ADC-C3: GPIO,CONNECTOR (J1.33), ADC (R42.1)
HSEC_ADC-C4: GPIO,CONNECTOR (J1.37), ADC (R43.1)
HSEC_ADC-C5: GPIO,CONNECTOR (J1.39), ADC (R44.1)
HSEC_ADC-D0: GPIO,CONNECTOR (J1.28), ADC (R45.1)
HSEC_ADC-D1: GPIO,CONNECTOR (J1.30), ADC (R46.1)
HSEC_ADC-D2: GPIO,CONNECTOR (J1.34), ADC (R47.1)
HSEC_ADC-D3: GPIO,CONNECTOR (J1.36), ADC (R48.1)
HSEC_ADC-D4: GPIO,CONNECTOR (J1.40), ADC (R49.1)
HSEC_ADC-D5: GPIO,CONNECTOR (J1.42), ADC (R50.1)
HSEC_ADC-VREFHI: GPIO,CONNECTOR (J1.45), ADC (R59.2)
HSEC_ADCIN14: GPIO,CONNECTOR (J1.25), ADC (R39.1)
HSEC_ADCIN15: GPIO,CONNECTOR (J1.27), ADC (R40.1)
MCU_GPIO-20: GPIO,CONNECTOR (J1.68 J1.86 U1.F2 U1.U14), SUPPORT (U2.3)
MCU_GPIO-28: GPIO,CONNECTOR (J1.76 U1.V11), EMULATOR_INTERFACE (A:SW1.3)
MCU_GPIO-29_L: GPIO,CONNECTOR (J1.78 U1.W11), EMULATOR_INTERFACE (A:U8.3)
MCU_GPIO-31_L: GPIO,CONNECTOR (J1.82 U1.U11), SUPPORT (U2.1)
MCU_GPIO-53_L: GPIO,CONNECTOR (J1.109 U1.P17), SUPPORT (J9.41)
MCU_GPIO-54_L: GPIO,CONNECTOR (J1.100 U1.P18), SUPPORT (J9.40)
MCU_GPIO-55_L: GPIO,CONNECTOR (J1.102 U1.P19), SUPPORT (J9.39)
MCU_GPIO-56_L: GPIO,CONNECTOR (J1.104 U1.N16), SUPPORT (J9.38)
MCU_GPIO-57_L: GPIO,CONNECTOR (J1.106 U1.N18), SUPPORT (J9.37)
MCU_GPIO-58_L: GPIO,CONNECTOR (J1.108 U1.N17), SUPPORT (J9.36)
MCU_GPIO-59_L: GPIO,CONNECTOR (J1.110 R7.1), SUPPORT (J9.35)
MCU_GPIO-60_L: GPIO,CONNECTOR (J1.125 U1.M17), SUPPORT (J9.34)
MCU_GPIO-61_L: GPIO,CONNECTOR (J1.126 R8.1), SUPPORT (J9.28)
MCU_GPIO-62_L: GPIO,CONNECTOR (J1.127 U1.J17), SUPPORT (J9.27)
MCU_GPIO-63_L: GPIO,CONNECTOR (J1.128 U1.J16), SUPPORT (J9.26)
MCU_GPIO-64_L: GPIO,CONNECTOR (J1.129 R3.2), SUPPORT (J9.25)
MCU_GPIO-65_L: GPIO,CONNECTOR (J1.130 U1.K16), SUPPORT (J9.24)
MCU_GPIO-66_L: GPIO,CONNECTOR (J1.131 R4.2), SUPPORT (J9.23)
MCU_GPIO-67_L: GPIO,CONNECTOR (J1.132 U1.B19), SUPPORT (J9.22)
MCU_GPIO-68_L: GPIO,CONNECTOR (J1.133 U1.C18), SUPPORT (J9.21)
MCU_GPIO-72_L: GPIO,CONNECTOR (J1.139 R6.2), SUPPORT (R20.2 SW1.2)
MCU_GPIO-84: GPIO,CONNECTOR (J1.151 U1.A11), SUPPORT (R21.2 SW1.1)
MCU_GPIO-91: GPIO,CONNECTOR (J1.160 U1.B5), SUPPORT (R26.2)
MCU_GPIO-92_L: GPIO,CONNECTOR (J1.161 U1.A4), SUPPORT (R25.1)
MCU_GPIO-96: GPIO,CONNECTOR (U1.C3), SUPPORT (J9.18)
MCU_GPIO-97: GPIO,CONNECTOR (U1.A2), SUPPORT (J9.17)
MCU_GPIO-98: GPIO,CONNECTOR (U1.F1), SUPPORT (J9.4)
MCU_GPIO-99: GPIO,CONNECTOR (U1.G1), SUPPORT (J9.5)
MCU_GPIO-100: GPIO,CONNECTOR (U1.H1), SUPPORT (J9.6)
MCU_GPIO-101: GPIO,CONNECTOR (U1.H2), SUPPORT (J9.7)
MCU_GPIO-102: GPIO,CONNECTOR (U1.H3), SUPPORT (J9.8)
MCU_GPIO-103: GPIO,CONNECTOR (U1.J1), SUPPORT (J9.9)
MCU_GPIO-104: GPIO,CONNECTOR (U1.J2), SUPPORT (J9.11)
MCU_GPIO-105: GPIO,CONNECTOR (U1.J3), SUPPORT (J9.12)
MCU_GPIO-106: GPIO,CONNECTOR (U1.L2), SUPPORT (J9.13)
MCU_GPIO-107: GPIO,CONNECTOR (U1.L3), SUPPORT (J9.14)
MCU_GPIO-108: GPIO,CONNECTOR (U1.L4), SUPPORT (J9.15)
MCU_GPIO-109: GPIO,CONNECTOR (U1.N2), SUPPORT (J9.16)
MCU_GPIO-110: GPIO,CONNECTOR (U1.M2), SUPPORT (J9.50)
MCU_GPIO-111: GPIO,CONNECTOR (U1.M4), SUPPORT (J9.2)
MCU_GPIO-112: GPIO,CONNECTOR (U1.M3), SUPPORT (J9.3)
MCU_GPIO-113: GPIO,CONNECTOR (U1.N4), SUPPORT (J9.47)
MCU_GPIO-114: GPIO,CONNECTOR (U1.N3), SUPPORT (J9.48)
MCU_GPIO-115: GPIO,CONNECTOR (U1.V12), SUPPORT (J9.59)
MCU_GPIO-116: GPIO,CONNECTOR (U1.W10), SUPPORT (J9.43)
MCU_GPIO-117: GPIO,CONNECTOR (U1.U12), SUPPORT (J9.58)
MCU_GPIO-118: GPIO,CONNECTOR (U1.T12), SUPPORT (J9.46)
MCU_GPIO-119: GPIO,CONNECTOR (U1.T15), SUPPORT (J9.20)
MCU_GPIO-120: GPIO,CONNECTOR (J7.2 U1.U15), SUPPORT (J9.45)
MCU_GPIO-121: GPIO,CONNECTOR (J6.2 U1.W16), SUPPORT (J9.44)
MCU_GPIO-122: GPIO,CONNECTOR (U1.T8), SUPPORT (J9.32 U5.3)
MCU_GPIO-123: GPIO,CONNECTOR (U1.U8), SUPPORT (J9.33 U5.7)
MCU_GPIO-124: GPIO,CONNECTOR (U1.V8), SUPPORT (J9.31 U5.5)
MCU_GPIO-125: GPIO,CONNECTOR (U1.T9), SUPPORT (J9.30 R15.2 U5.2)
MCU_GPIO-136: GPIO,CONNECTOR (U1.T17), SUPPORT (J9.49)
MCU_GPIO-137: GPIO,CONNECTOR (U1.T18), SUPPORT (J9.60)
MCU_GPIO-168: GPIO,CONNECTOR (U1.D4), SUPPORT (5 pins)
MCU_TCK: GPIO,CONNECTOR (J1.5), SUPPORT (U1.V15), EMULATOR_INTERFACE (A:U9.14)
MCU_TDI: GPIO,CONNECTOR (J1.8), SUPPORT (U1.W13), EMULATOR_INTERFACE (A:U9.18)
MCU_TDO: GPIO,CONNECTOR (J1.6), SUPPORT (R10.1), EMULATOR_INTERFACE (A:U9.11)
MCU_TMS: GPIO,CONNECTOR (J1.3), SUPPORT (U1.W14), EMULATOR_INTERFACE (A:U9.12)
MCU_TRSTN: GPIO,CONNECTOR (J1.4), SUPPORT (R9.2 U1.V14), EMULATOR_INTERFACE (A:U9.16)
MCU_XRSN: GPIO,CONNECTOR (J1.120), SUPPORT (6 pins)
OSC_GND: POWER (U1.H18 U1.H19), SUPPORT (5 pins)
USB0_EPEN: GPIO,CONNECTOR (J6.1), USB (R81.1)
USB0_GPIO-42: GPIO,CONNECTOR (J2.1), USB (R76.1)
USB0_GPIO-43: GPIO,CONNECTOR (J3.1), USB (R77.1)
USB0_GPIO-46: GPIO,CONNECTOR (J4.1), USB (R79.1 R80.1)
USB0_GPIO-47: GPIO,CONNECTOR (J5.1), USB (R82.1)
USB0_PFLT: GPIO,CONNECTOR (J7.1), USB (R78.1)